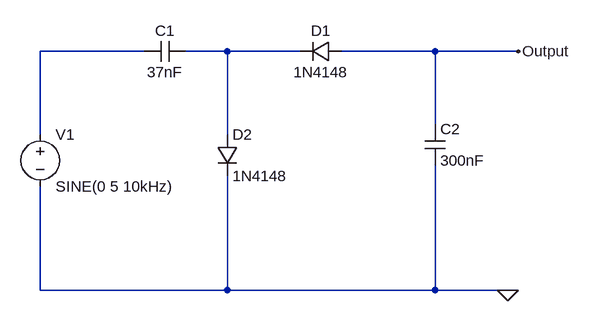
[diagram p0: schematic voltage_doubler.asc]
voltage_doubler.asc, the LTspice schematic file:
Version 4
SHEET 1 936 680
WIRE 272 192 112 192
WIRE 400 192 336 192
WIRE 512 192 400 192
WIRE 720 192 576 192
WIRE 848 192 720 192
WIRE 720 304 720 192
WIRE 112 320 112 192
WIRE 400 320 400 192
WIRE 112 560 112 400
WIRE 400 560 400 384
WIRE 400 560 112 560
WIRE 720 560 720 368
WIRE 720 560 400 560
WIRE 832 560 720 560
WIRE 848 560 832 560
FLAG 848 192 Output
FLAG 832 560 0
SYMBOL voltage 112 304 R0
SYMATTR InstName V1
SYMATTR Value SINE(0 5 10kHz)
SYMBOL cap 336 176 R90
WINDOW 0 0 32 VBottom 2
WINDOW 3 32 32 VTop 2
SYMATTR InstName C1
SYMATTR Value 37nF
SYMBOL diode 576 176 R90
WINDOW 0 0 32 VBottom 2
WINDOW 3 32 32 VTop 2
SYMATTR InstName D1
SYMATTR Value 1N4148
SYMBOL diode 384 320 R0
SYMATTR InstName D2
SYMATTR Value 1N4148
SYMBOL cap 704 304 R0
SYMATTR InstName C2
SYMATTR Value 300nF

The netlist it stands for:
* voltage_doubler.asc
V1 N001 0 SINE(0 5 10kHz)
C1 N002 N001 37nF
D1 Output N002 1N4148
D2 N002 0 1N4148
C2 Output 0 300nF
.model D D
.lib standard.dio
.backanno
.end